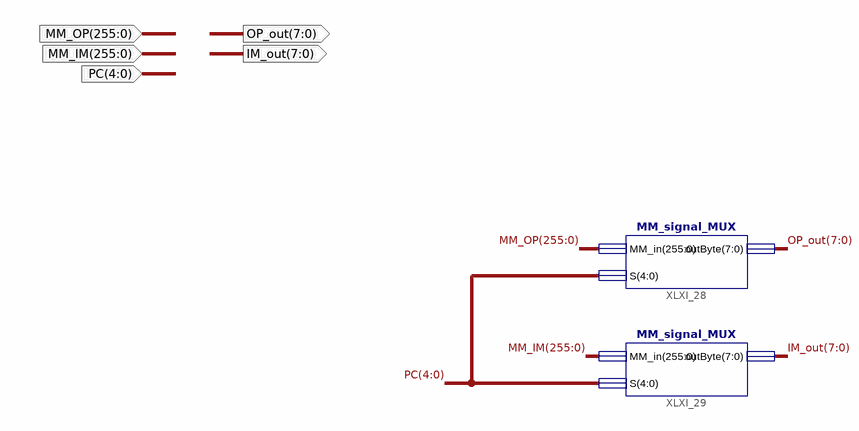
[diagram p0: schematic sheet 1]
// Xilinx ISE schematic MM_Decode_MUX.sch (spartan3e) as structural Verilog: 2 symbols, 5 ports
module MM_Decode_MUX (
  input  [255:0] MM_OP,
  input  [4:0] PC,
  input  [255:0] MM_IM,
  output [7:0] OP_out,
  output [7:0] IM_out
);

  MM_signal_MUX XLXI_28 (.MM_in(MM_OP), .S(PC), .outByte(OP_out));
  MM_signal_MUX XLXI_29 (.MM_in(MM_IM), .S(PC), .outByte(IM_out));
endmodule
